# Altium schematic sheet Test Mux.SchDoc
size A4
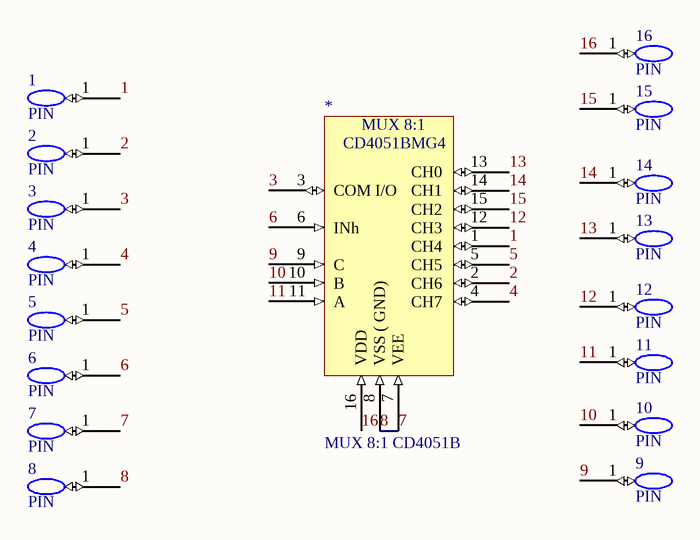
[diagram p0: Test Mux.SchDoc]

## Parts
1  PIN  [TESTPOINT]
2  PIN  [TESTPOINT]
3  PIN  [TESTPOINT]
4  PIN  [TESTPOINT]
5  PIN  [TESTPOINT]
6  PIN  [TESTPOINT]
7  PIN  [TESTPOINT]
8  PIN  [TESTPOINT]
9  PIN  [TESTPOINT]
10  PIN  [TESTPOINT]
11  PIN  [TESTPOINT]
12  PIN  [TESTPOINT]
13  PIN  [TESTPOINT]
14  PIN  [TESTPOINT]
15  PIN  [TESTPOINT]
16  PIN  [TESTPOINT]
*  MUX 8:1 CD4051B  [MUX 8:1*]

## Nets
1: 1.1 *.1(CH4)
2: 2.1 *.2(CH6)
3: 3.1 *.3(COM_I/O)
4: 4.1 *.4(CH7)
5: 5.1 *.5(CH5)
6: 6.1 *.6(INh)
7: 7.1 8.1 *.7(VEE) *.8(VSS_(_GND))  [also labelled 8]
9: 9.1 *.9(C)
10: 10.1 *.10(B)
11: 11.1 *.11(A)
12: 12.1 *.12(CH3)
13: 13.1 *.13(CH0)
14: 14.1 *.14(CH1)
15: 15.1 *.15(CH2)
16: 16.1 *.16(VDD)

## Notes on the sheet
- (in symbol MUX 8:1 CD4051B) MUX 8:1; CD4051BMG4